# EAGLE schematic BeeBeeAte-RemoteBoard (EAGLE 9.6.2)

## Sheet 1 of 3: ESP-32 mit USB Schnitstelle und Joystick
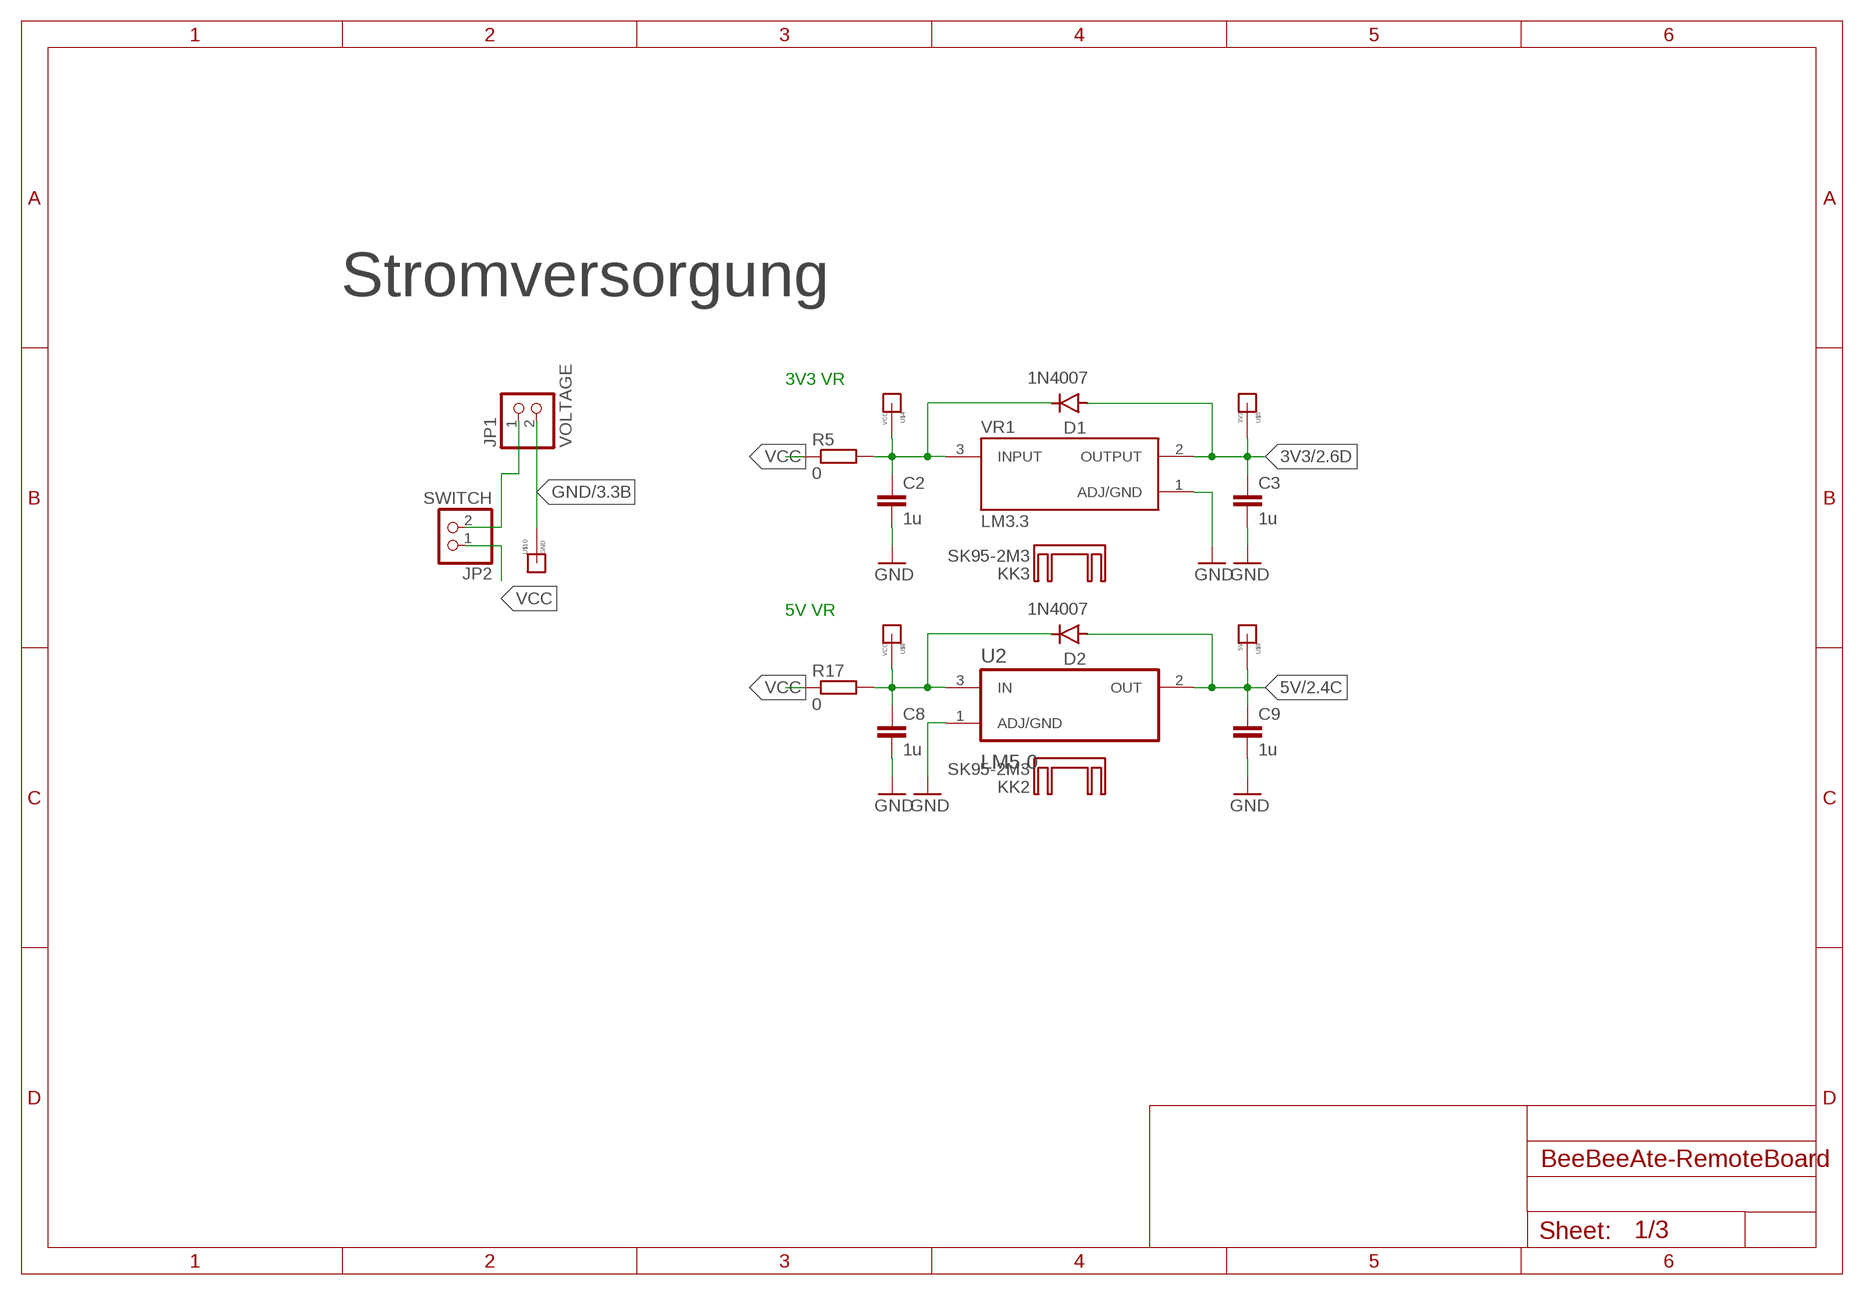
[diagram p0: schematic, sheet 1]

### Parts
C2  1u  C-EUC0805  [C0805]
C3  1u  C-EUC0805  [C0805]
C8  1u  C-EUC0805  [C0805]
C9  1u  C-EUC0805  [C0805]
D1  1N4007  [DO-41]
D2  1N4007  [DO-41]
JP1  VOLTAGE  PINHD-1X2  [1X02]
JP2  SWITCH  PINHD-1X2  [1X02]
KK2  SK95-2M3  [SK95-2M3]
KK3  SK95-2M3  [SK95-2M3]
R5  0  R-EU_R0805  [R0805]
R17  0  R-EU_R0805  [R0805]
U2  LM5.0  LM1117T-5.0  [TO254P1054X470X1955-3]
U$4  VCC  MESSPAD  [MESSPAD]
U$5  3V3  MESSPAD  [MESSPAD]
U$8  VCC  MESSPAD  [MESSPAD]
U$9  5V  MESSPAD  [MESSPAD]
U$10  GND  MESSPAD  [MESSPAD]
VR1  LM3.3  LM1117T-3.3/NOPB  [TO254P1054X470X1955-3]

### Nets
3V3: C3.1 D1.A U$5.MSP VR1.2(OUTPUT) ; also sheet 2,3
5V: C9.1 D2.A U2.2(OUT) U$9.MSP ; also sheet 2
GND: C2.2 C3.2 C8.2 C9.2 JP1.2 U2.1(ADJ/GND) U$10.MSP VR1.1(ADJ/GND) ; also sheet 2,3
N$3: C8.1 D2.C R17.2 U2.3(IN) U$8.MSP
N$4: C2.1 D1.C R5.2 U$4.MSP VR1.3(INPUT)
N$5: JP1.1 JP2.2
VCC: JP2.1 R5.1 R17.1

### Notes on the sheet
- Stromversorgung
- 3V3 VR
- 5V VR

## Sheet 2 of 3: ESP 32
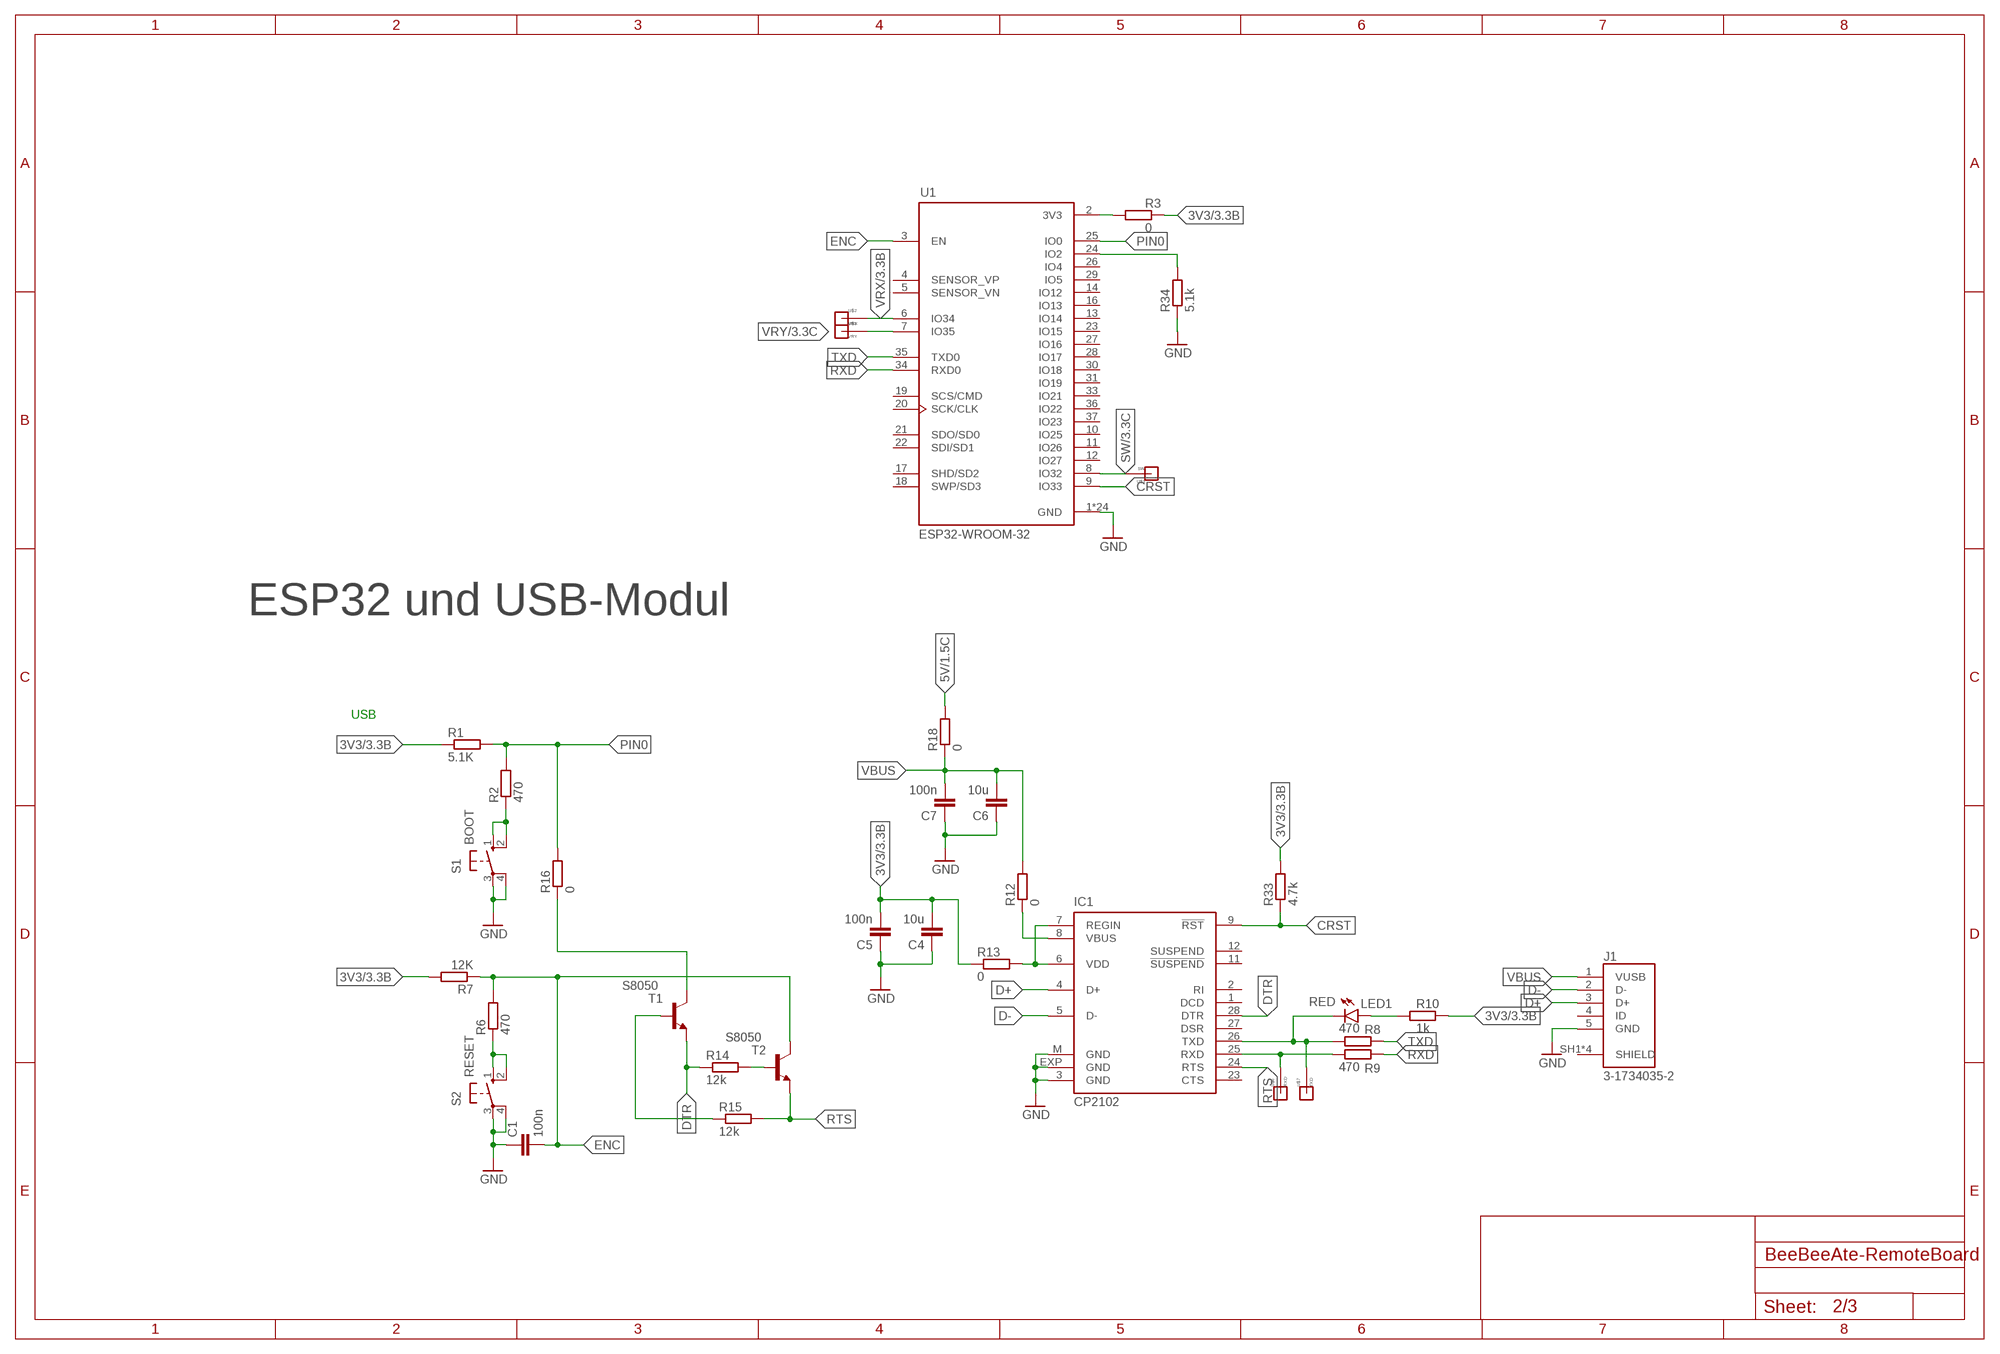
[diagram p1: schematic, sheet 2]

### Parts
C1  100n  C-EUC0805  [C0805]
C4  10u  C-EUC0805  [C0805]
C5  100n  C-EUC0805  [C0805]
C6  10u  C-EUC0805  [C0805]
C7  100n  C-EUC0805  [C0805]
IC1  CP2102  [MLP28]
J1  3-1734035-2  [TE_3-1734035-2]
LED1  RED  LEDCHIP-LED0805  [CHIP-LED0805]
R1  5.1K  R-EU_R0805  [R0805]
R2  470  R-EU_R0805  [R0805]
R3  0  R-EU_R0805  [R0805]
R6  470  R-EU_R0805  [R0805]
R7  12K  R-EU_R0805  [R0805]
R8  470  R-EU_R0805  [R0805]
R9  470  R-EU_R0805  [R0805]
R10  1k  R-EU_R0805  [R0805]
R12  0  R-EU_R0805  [R0805]
R13  0  R-EU_R0805  [R0805]
R14  12k  R-EU_R0805  [R0805]
R15  12k  R-EU_R0805  [R0805]
R16  0  R-EU_R0805  [R0805]
R18  0  R-EU_R0805  [R0805]
R33  4.7k  R-EU_R0805  [R0805]
R34  5.1k  R-EU_R0805  [R0805]
S1  BOOT  10-XX  [B3F-10XX]
S2  RESET  10-XX  [B3F-10XX]
T1  S8050  BC808-NPN-SOT23-BEC  [SOT23-BEC]
T2  S8050  BC808-NPN-SOT23-BEC  [SOT23-BEC]
U1  ESP32-WROOM-32  [MODULE_ESP32-WROOM-32]
U$1  VRY  MESSPAD  [MESSPAD]
U$2  VRX  MESSPAD  [MESSPAD]
U$3  SW  MESSPAD  [MESSPAD]
U$6  RXD  MESSPAD  [MESSPAD]
U$7  TXD  MESSPAD  [MESSPAD]

### Nets
3V3: C4.2 C5.2 R1.1 R3.2 R7.2 R10.2 R13.1 R33.2 ; also sheet 1,3
5V: R18.2 ; also sheet 1
CRST: IC1.9(!RST) R33.1 U1.9(IO33)
D+: IC1.4(D+) J1.3(D+)
D-: IC1.5(D-) J1.2(D-)
DTR: IC1.28(DTR) R14.1 T1.E
ENC: C1.2 R6.2 R7.1 T2.C U1.3(EN)
GND: C1.1 C4.1 C5.1 C6.1 C7.1 IC1.3(GND) IC1.EXP(GND) IC1.M(GND) J1.5(GND) R34.1 S1.3(P) S1.4(P1) S2.3(P) S2.4(P1) U1.1(GND) U1.15(GND) U1.38(GND) U1.39_1(GND) U1.39_2(GND) U1.39_3(GND) U1.39_4(GND) U1.39_5(GND) U1.39_6(GND) U1.39_7(GND) U1.39_8(GND) U1.39_9(GND) U1.39_10(GND) U1.39_11(GND) U1.39_12(GND) U1.39_13(GND) U1.39_14(GND) U1.39_15(GND) U1.39_16(GND) U1.39_17(GND) U1.39_18(GND) U1.39_19(GND) U1.39_20(GND) U1.39_21(GND) ; also sheet 1,3
N$1: R2.1 S1.1(S) S1.2(S1)
N$2: R6.1 S2.1(S) S2.2(S1)
N$6: IC1.25(RXD) R9.1 U$6.MSP
N$7: LED1.A R10.1
N$9: IC1.26(TXD) LED1.C R8.1 U$7.MSP
N$10: IC1.6(VDD) IC1.7(REGIN) R13.2
N$11: IC1.8(VBUS) R12.1
N$12: R14.2 T2.B
N$14: R15.1 T1.B
N$15: R3.1 U1.2(3V3)
N$25: R34.2 U1.24(IO2)
PIN0: R1.2 R2.2 R16.2 U1.25(IO0)
PIN1: R16.1 T1.C
RTS: IC1.24(RTS) R15.2 T2.E
RXD: R9.2 U1.34(RXD0)
SW: U1.8(IO32) U$3.MSP ; also sheet 3
TXD: R8.2 U1.35(TXD0)
VBUS: C6.2 C7.2 J1.1(VUSB) R12.2 R18.1
VRX: U1.6(IO34) U$2.MSP ; also sheet 3
VRY: U1.7(IO35) U$1.MSP ; also sheet 3
Unconnected: IC1.1(DCD) IC1.2(RI) IC1.11(!SUSPEND) IC1.12(SUSPEND) IC1.23(CTS) IC1.27(DSR) J1.4(ID) J1.SH1(SHIELD) J1.SH2(SHIELD) J1.SH3(SHIELD) J1.SH4(SHIELD) U1.4(SENSOR_VP) U1.5(SENSOR_VN) U1.10(IO25) U1.11(IO26) U1.12(IO27) U1.13(IO14) U1.14(IO12) U1.16(IO13) U1.17(SHD/SD2) U1.18(SWP/SD3) U1.19(SCS/CMD) U1.20(SCK/CLK) U1.21(SDO/SD0) U1.22(SDI/SD1) U1.23(IO15) U1.26(IO4) U1.27(IO16) U1.28(IO17) U1.29(IO5) U1.30(IO18) U1.31(IO19) U1.33(IO21) U1.36(IO22) U1.37(IO23)

### Notes on the sheet
- ESP32 und USB-Modul
- USB

## Sheet 3 of 3: Joystick
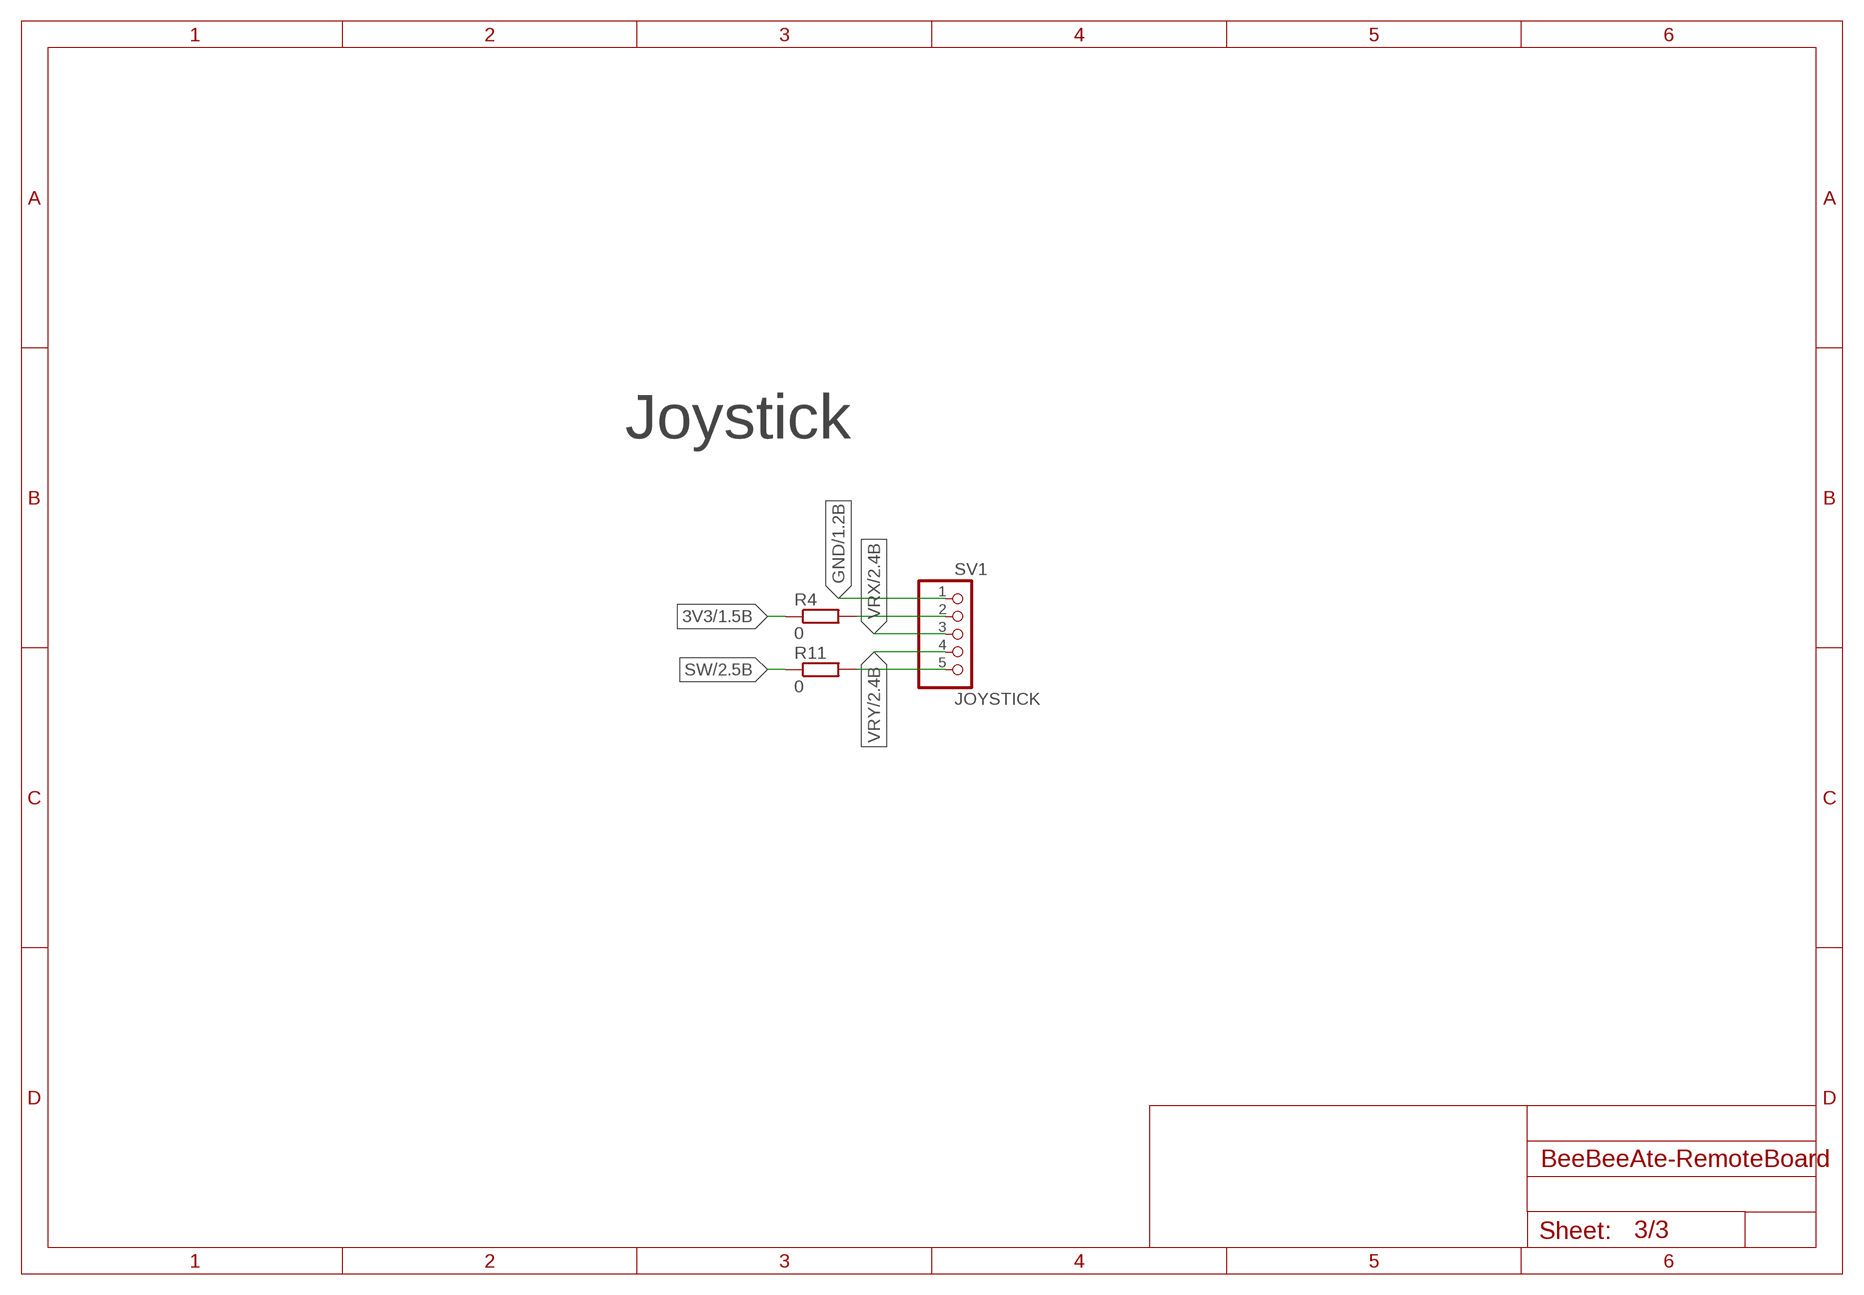
[diagram p2: schematic, sheet 3]

### Parts
R4  0  R-EU_R0805  [R0805]
R11  0  R-EU_R0805  [R0805]
SV1  JOYSTICK  PINHD-1X5/90  [1X05/90]

### Nets
3V3: R4.1 ; also sheet 1,2
GND: SV1.1 ; also sheet 1,2
N$8: R4.2 SV1.2
N$13: R11.2 SV1.5
SW: R11.1 ; also sheet 2
VRX: SV1.3 ; also sheet 2
VRY: SV1.4 ; also sheet 2

### Notes on the sheet
- Joystick

## Library data of the parts
C1-C9 = rcl:C-EU: CAPACITOR, European symbol; SPICEPREFIX: C
D1 D2 = Diodes:1N4007: DIODE GEN PURP 1KV 1A DO41 Manufacturer's datasheet <https://www.mccsemi.com/pdf/Products/1N4001-1N4007(DO-41).pdf>; CREATED_BY: PCBLayout.com; DIGIKEY_PART_NUMBER: 1N4007MSCT-ND; MANUFACTURER: Micro Commercial Co; MPN: 1N4007; PACKAGE: DO-41
IC1 = silabs:CP210*: Single-Chip USB to UART Bridge Source: www.silabs.com .. CP2101.pdf / cp2102.pdf; MF: FARNELL; MPN: CP2102-GM; OC_FARNELL: 9282130; OC_NEWARK: 30K5635
J1 = 3-1734035-2:3-1734035-2: USB Connectors MINI USB, R/A, SMT, MATTE TIN, W/O MYLAR Check prices <https://pricing.snapeda.com/parts/3-1734035-2/TE%20Connectivity/view-part?ref=eda>; AVAILABILITY: In Stock; COMMENT: 3-1734035-2; DESCRIPTION: USB Connectors MINI USB, R/A, SMT, MATTE TIN, W/O MYLAR; MF: TE Connectivity; MP: 3-1734035-2; PACKAGE: None; PRICE: None; PURCHASE-URL: https://pricing.snapeda.com/search/part/3-1734035-2/?ref=eda
JP1 JP2 = pinhead:PINHD-1X2: PIN HEADER
KK2 KK3 = heatsink:SK95-2M3: HEATSINK manufacturer Fischer/distributor Buerklin
LED1 = led:LED: LED OSRAM: - CHIPLED LG R971, LG N971, LY N971, LG Q971, LY Q971, LO R971, LY R971 LH N974, LH R974 LS Q976, LO Q976, LY Q976 LO Q996 - Hyper CHIPLED LW Q18S LB Q993, LB Q99A, LB R99A - SideLED LS A670, LO A670, LY A670, LG A670, LP A670 LB A673, LV A673, LT A673, LW A673 LH A674 LY A675 LS A676, LA A676, LO A676, LY A676, LW A676 LS A679, LY A679, LG A679 - Hyper Micro SIDELED® LS Y876, LA Y876, LO Y876, LY Y876 LT Y87S - SmartLED LW L88C, LW L88S LB L89C, LB L89S, LG L890 LS L89K, LO L89K, LY L89K LS L896, LA L896, LO L896, LY L896 - TOPLED LS T670, LO T670, LY T670, LG T670, LP T670 LSG T670, LSP T670, LSY T670, LOP T670, LYG T670 LG T671, LOG T671, LSG T671 LB T673, LV T673, LT T673, LW T673 LH T674 LS T676, LA T676, LO T676, LY T676, LB T676, LH T676, LSB T676, LW T676 LB T67C, LV T67C, LT T67C, LS T67K, LO T67K, LY T67K, LW E67C LS E67B, LA E67B, LO E67B, LY E67B, LB E67C, LV E67C, LT E67C LW T67C LS T679, LY T679, LG T679 LS T770, LO T770, LY T770, LG T770, LP T770 LB T773, LV T773, LT T773, LW T773 LH T774 LS E675, LA E675, LY E675, LS T675 LS T776, LA T776, LO T776, LY T776, LB T776 LHGB T686 LT T68C, LB T68C - Hyper Mini TOPLED® LB M676 - Mini TOPLED Santana® LG M470 LS M47K, LO M47K, LY M47K Source: http://www.osram.convergy.de LUXEON: - LUMILED® LXK2-PW12-R00, LXK2-PW12-S00, LXK2-PW14-U00, LXK2-PW14-V00 LXK2-PM12-R00, LXK2-PM12-S00, LXK2-PM14-U00 LXK2-PE12-Q00, LXK2-PE12-R00, LXK2-PE12-S00, LXK2-PE14-T00, LXK2-PE14-U00 LXK2-PB12-K00, LXK2-PB12-L00, LXK2-PB12-M00, LXK2-PB14-N00, LXK2-PB14-P00, LXK2-PB14-Q00 LXK2-PR12-L00, LXK2-PR12-M00, LXK2-PR14-Q00, LXK2-PR14-R00 LXK2-PD12-Q00, LXK2-PD12-R00, LXK2-PD12-S00 LXK2-PH12-R00, LXK2-PH12-S00 LXK2-PL12-P00, LXK2-PL12-Q00, LXK2-PL12-R00 Source: www.luxeon.com KINGBRIGHT: KA-3528ASYC Source: www.kingbright.com
R1-R18 R33 R34 = rcl:R-EU_: RESISTOR, European symbol; SPICEPREFIX: R
S1 S2 = switch-omron:10-XX: OMRON SWITCH; MPN: B3F-1000; OC_FARNELL: 176432; OC_NEWARK: 36M3542
SV1 = pinhead:PINHD-1X5: PIN HEADER
T1 T2 = transistor:*-NPN-: NPN Transistror BF959 corrected 2008.03.06
U1 = ESP32-WROOM-32:ESP32-WROOM-32: Bluetooth, WiFi Transceiver Module 2.4GHz ~ 2.5GHz Surface Mount Check prices <https://pricing.snapeda.com/parts/ESP32-WROOM-32/Espressif%20Systems/view-part?ref=eda>; AVAILABILITY: In Stock; DESCRIPTION: Bluetooth, WiFi 802.11b/g/n, Bluetooth v4.2 +EDR, Class 1, 2 and 3 Transceiver Module 2.4GHz ~ 2.5GHz Antenna Not Included, U.FL Surface Mount; MF: Espressif Systems; MP: ESP32-WROOM-32; PACKAGE: Module Espressif Systems; PRICE: None; PURCHASE-URL: https://pricing.snapeda.com/search/part/ESP32-WROOM-32/?ref=eda
U2 = LM1117T-5.0:LM1117T-5.0: Check prices <https://pricing.snapeda.com/parts/LM1117T-5.0/NOPB/Texas%20Instruments/view-part?ref=eda>; AVAILABILITY: In Stock; DESCRIPTION: 800-mA 15-V linear voltage regulator 3-TO-220 0 to 125; MF: Texas Instruments; MP: LM1117T-5.0/NOPB; PACKAGE: TO-220-3 Texas Instruments; PRICE: None; PURCHASE-URL: https://pricing.snapeda.com/search/part/LM1117T-5.0/NOPB/?ref=eda
U$1-U$10 = 03lanfra-PADS:MESSPAD
VR1 = LM1117T-3.3:LM1117T-3.3/NOPB: Check prices <https://pricing.snapeda.com/parts/LM1117T-3.3/NOPB/Texas%20Instruments/view-part?ref=eda>; AVAILABILITY: In Stock; DESCRIPTION: 800-mA 15-V linear voltage regulator 3-TO-220 0 to 125; MF: Texas Instruments; MP: LM1117T-3.3/NOPB; PACKAGE: TO-220-3 Texas Instruments; PRICE: None; PURCHASE-URL: https://pricing.snapeda.com/search/part/LM1117T-3.3/NOPB/?ref=eda